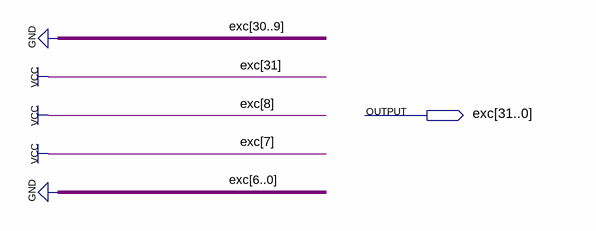
[diagram p0: schematic sheet]
// Quartus schematic numeroexcessao.bdf as structural Verilog: 0 symbols, 1 pins
module numeroexcessao (
  output [31:0] exc
);


  assign exc = 32'b10000000000000000000000110000000;
endmodule
